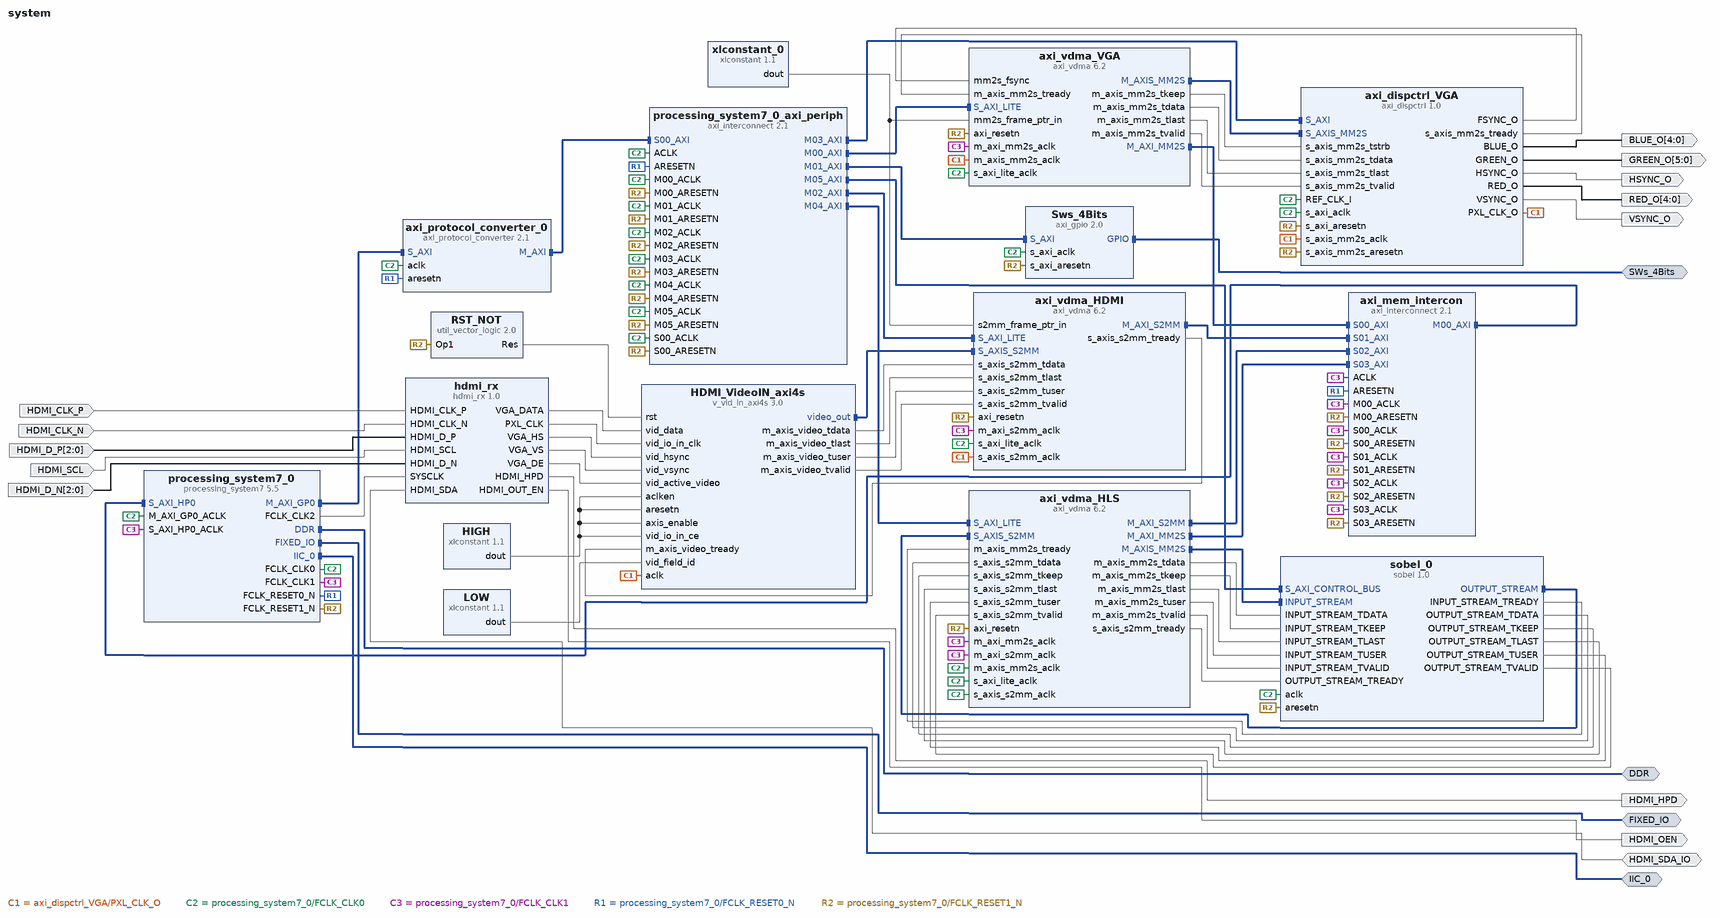
[diagram p0: block diagram of the top level]
# Vivado block design system, Vivado 2014.4
create_bd_design system

create_bd_intf_port -mode Master -vlnv xilinx.com:interface:ddrx_rtl:1.0 DDR
create_bd_intf_port -mode Master -vlnv xilinx.com:display_processing_system7:fixedio_rtl:1.0 FIXED_IO
create_bd_intf_port -mode Master -vlnv xilinx.com:interface:iic_rtl:1.0 IIC_0
create_bd_intf_port -mode Master -vlnv xilinx.com:interface:gpio_rtl:1.0 SWs_4Bits
create_bd_port -dir O HSYNC_O
create_bd_port -dir O VSYNC_O
create_bd_port -dir I HDMI_CLK_P
create_bd_port -dir I HDMI_CLK_N
create_bd_port -dir I -from 2 -to 0 HDMI_D_P
create_bd_port -dir I HDMI_SCL
create_bd_port -dir I -from 2 -to 0 HDMI_D_N
create_bd_port -dir O -from 4 -to 0 RED_O
create_bd_port -dir O -from 5 -to 0 GREEN_O
create_bd_port -dir O -from 4 -to 0 BLUE_O
create_bd_port -dir O HDMI_HPD
create_bd_port -dir O HDMI_OEN
create_bd_port -dir IO HDMI_SDA_IO

create_bd_cell -type ip -vlnv Digilent:digilent:axi_dispctrl:1.0 axi_dispctrl_VGA
set_property -dict {CONFIG.C_BLUE_WIDTH 5 CONFIG.C_GREEN_WIDTH 6 CONFIG.C_RED_WIDTH 5} [get_bd_cells axi_dispctrl_VGA]
create_bd_cell -type ip -vlnv xilinx.com:ip:axi_vdma:6.2 axi_vdma_VGA
set_property -dict [list \
  CONFIG.c_m_axi_mm2s_data_width 64 \
  CONFIG.c_m_axis_mm2s_tdata_width 32 \
  CONFIG.c_use_mm2s_fsync 1 \
  CONFIG.c_mm2s_genlock_mode 1 \
  CONFIG.c_mm2s_linebuffer_depth 2048 \
  CONFIG.c_mm2s_max_burst_length 8 \
  CONFIG.c_include_s2mm 0 \
  CONFIG.c_enable_debug_all 1 \
  CONFIG.c_enable_debug_info_6 0 \
  CONFIG.c_enable_debug_info_7 0 \
  CONFIG.c_enable_debug_info_14 0 \
  CONFIG.c_enable_debug_info_15 0 \
  CONFIG.c_include_mm2s_dre 1 \
] [get_bd_cells axi_vdma_VGA]
create_bd_cell -type ip -vlnv xilinx.com:ip:axi_vdma:6.2 axi_vdma_HDMI
set_property -dict [list \
  CONFIG.c_m_axi_s2mm_data_width 64 \
  CONFIG.c_include_s2mm_dre 1 \
  CONFIG.c_s2mm_genlock_mode 2 \
  CONFIG.c_s2mm_linebuffer_depth 2048 \
  CONFIG.c_include_mm2s 0 \
  CONFIG.c_include_s2mm 1 \
  CONFIG.c_enable_debug_all 1 \
  CONFIG.c_enable_debug_info_6 0 \
  CONFIG.c_enable_debug_info_7 0 \
  CONFIG.c_enable_debug_info_14 0 \
  CONFIG.c_enable_debug_info_15 0 \
] [get_bd_cells axi_vdma_HDMI]
create_bd_cell -type ip -vlnv xilinx.com:ip:processing_system7:5.5 processing_system7_0
set_property -dict [list \
  CONFIG.PCW_FCLK_CLK1_BUF true \
  CONFIG.PCW_FCLK_CLK2_BUF true \
  CONFIG.PCW_UIPARAM_DDR_FREQ_MHZ 525.000000 \
  CONFIG.PCW_CRYSTAL_PERIPHERAL_FREQMHZ 50.000000 \
  CONFIG.PCW_APU_PERIPHERAL_FREQMHZ 650.000000 \
  CONFIG.PCW_SDIO_PERIPHERAL_FREQMHZ 50 \
  CONFIG.PCW_UART_PERIPHERAL_FREQMHZ 50 \
  CONFIG.PCW_I2C_PERIPHERAL_FREQMHZ 108.333336 \
  CONFIG.PCW_FPGA0_PERIPHERAL_FREQMHZ 100.000000 \
  CONFIG.PCW_FPGA1_PERIPHERAL_FREQMHZ 150 \
  CONFIG.PCW_FPGA2_PERIPHERAL_FREQMHZ 200 \
  CONFIG.PCW_FPGA3_PERIPHERAL_FREQMHZ 200.000000 \
  CONFIG.PCW_USE_S_AXI_HP0 1 \
  CONFIG.PCW_M_AXI_GP0_FREQMHZ 100 \
  CONFIG.PCW_S_AXI_HP0_FREQMHZ 150 \
  CONFIG.PCW_USE_FABRIC_INTERRUPT 1 \
  CONFIG.PCW_EN_CLK1_PORT 1 \
  CONFIG.PCW_EN_CLK2_PORT 1 \
  CONFIG.PCW_EN_RST1_PORT 1 \
  CONFIG.PCW_IMPORT_BOARD_PRESET ./lib/xml/ZYBO_zynq_def.xml \
  CONFIG.PCW_PRESET_BANK1_VOLTAGE {LVCMOS 3.3V} \
  CONFIG.PCW_UIPARAM_DDR_PARTNO {MT41K128M16 JT-125} \
  CONFIG.PCW_QSPI_PERIPHERAL_ENABLE 1 \
  CONFIG.PCW_QSPI_QSPI_IO {MIO 1 .. 6} \
  CONFIG.PCW_QSPI_GRP_SINGLE_SS_ENABLE 1 \
  CONFIG.PCW_QSPI_GRP_SINGLE_SS_IO {MIO 1 .. 6} \
  CONFIG.PCW_QSPI_GRP_FBCLK_ENABLE 1 \
  CONFIG.PCW_QSPI_GRP_FBCLK_IO {MIO 8} \
  CONFIG.PCW_ENET0_PERIPHERAL_ENABLE 0 \
  CONFIG.PCW_SD0_PERIPHERAL_ENABLE 1 \
  CONFIG.PCW_SD0_SD0_IO {MIO 40 .. 45} \
  CONFIG.PCW_SD0_GRP_CD_ENABLE 1 \
  CONFIG.PCW_SD0_GRP_CD_IO {MIO 47} \
  CONFIG.PCW_SD0_GRP_WP_ENABLE 1 \
  CONFIG.PCW_SD0_GRP_WP_IO EMIO \
  CONFIG.PCW_UART1_PERIPHERAL_ENABLE 1 \
  CONFIG.PCW_UART1_UART1_IO {MIO 48 .. 49} \
  CONFIG.PCW_TTC0_PERIPHERAL_ENABLE 1 \
  CONFIG.PCW_USB0_PERIPHERAL_ENABLE 1 \
  CONFIG.PCW_USB0_USB0_IO {MIO 28 .. 39} \
  CONFIG.PCW_USB0_RESET_ENABLE 1 \
  CONFIG.PCW_USB0_RESET_IO {MIO 46} \
  CONFIG.PCW_I2C0_PERIPHERAL_ENABLE 1 \
  CONFIG.PCW_I2C0_I2C0_IO EMIO \
  CONFIG.PCW_I2C_RESET_ENABLE 0 \
  CONFIG.PCW_GPIO_PERIPHERAL_ENABLE 1 \
  CONFIG.PCW_GPIO_MIO_GPIO_ENABLE 1 \
  CONFIG.PCW_FCLK1_PERIPHERAL_CLKSRC {DDR PLL} \
  CONFIG.PCW_DCI_PERIPHERAL_CLKSRC 1 \
  CONFIG.PCW_PCAP_PERIPHERAL_CLKSRC 1 \
  CONFIG.PCW_FPGA_FCLK1_ENABLE 1 \
  CONFIG.PCW_FPGA_FCLK2_ENABLE 1 \
] [get_bd_cells processing_system7_0]
# 203 more settings of processing_system7_0 are not shown: defaults, MIO pin electricals, DDR timing, and values the tool derives
create_bd_cell -type ip -vlnv xilinx.com:ip:xlconstant:1.1 xlconstant_0
set_property -dict {CONFIG.CONST_WIDTH 6 CONFIG.CONST_VAL 0} [get_bd_cells xlconstant_0]
create_bd_cell -type ip -vlnv xilinx.com:ip:axi_interconnect:2.1 axi_mem_intercon
set_property -dict [list \
  CONFIG.NUM_SI 4 \
  CONFIG.NUM_MI 1 \
  CONFIG.ENABLE_ADVANCED_OPTIONS 0 \
  CONFIG.M00_HAS_DATA_FIFO 1 \
] [get_bd_cells axi_mem_intercon]
create_bd_cell -type ip -vlnv xilinx.com:ip:axi_protocol_converter:2.1 axi_protocol_converter_0
set_property -dict [list \
  CONFIG.SI_PROTOCOL AXI3 \
  CONFIG.MI_PROTOCOL AXI4LITE \
  CONFIG.ID_WIDTH 12 \
] [get_bd_cells axi_protocol_converter_0]
create_bd_cell -type ip -vlnv xilinx.com:ip:axi_interconnect:2.1 processing_system7_0_axi_periph
set_property -dict [list \
  CONFIG.NUM_MI 6 \
  CONFIG.STRATEGY 1 \
  CONFIG.ENABLE_ADVANCED_OPTIONS 0 \
  CONFIG.M00_HAS_REGSLICE 4 \
  CONFIG.M01_HAS_REGSLICE 4 \
  CONFIG.M02_HAS_REGSLICE 4 \
  CONFIG.M03_HAS_REGSLICE 4 \
  CONFIG.M04_HAS_REGSLICE 4 \
  CONFIG.M05_HAS_REGSLICE 4 \
  CONFIG.M06_HAS_REGSLICE 4 \
  CONFIG.M07_HAS_REGSLICE 4 \
] [get_bd_cells processing_system7_0_axi_periph]
create_bd_cell -type ip -vlnv xilinx.com:ip:v_vid_in_axi4s:3.0 HDMI_VideoIN_axi4s
set_property -dict [list \
  CONFIG.C_M_AXIS_VIDEO_MAX_TDATASMPLS_PER_CLK 1 \
  CONFIG.C_M_AXIS_VIDEO_DATA_WIDTH 10 \
  CONFIG.RAM_ADDR_BITS 11 \
] [get_bd_cells HDMI_VideoIN_axi4s]
create_bd_cell -type ip -vlnv xilinx.com:ip:util_vector_logic:2.0 RST_NOT
set_property -dict {CONFIG.C_SIZE 1 CONFIG.C_OPERATION not} [get_bd_cells RST_NOT]
create_bd_cell -type ip -vlnv xilinx.com:ip:xlconstant:1.1 HIGH
create_bd_cell -type ip -vlnv xilinx.com:ip:xlconstant:1.1 LOW
set_property -dict {CONFIG.CONST_VAL 0} [get_bd_cells LOW]
create_bd_cell -type ip -vlnv xilinx.com:ip:axi_vdma:6.2 axi_vdma_HLS
set_property -dict [list \
  CONFIG.c_m_axi_s2mm_data_width 64 \
  CONFIG.c_include_s2mm_dre 1 \
  CONFIG.c_use_mm2s_fsync 0 \
  CONFIG.c_use_s2mm_fsync 0 \
  CONFIG.c_mm2s_genlock_mode 3 \
  CONFIG.c_s2mm_genlock_mode 2 \
  CONFIG.c_mm2s_linebuffer_depth 2048 \
  CONFIG.c_s2mm_linebuffer_depth 2048 \
  CONFIG.c_include_mm2s 1 \
  CONFIG.c_include_s2mm 1 \
  CONFIG.c_enable_debug_all 1 \
  CONFIG.c_enable_debug_info_6 0 \
  CONFIG.c_enable_debug_info_7 0 \
  CONFIG.c_enable_debug_info_14 0 \
  CONFIG.c_enable_debug_info_15 0 \
  CONFIG.c_include_mm2s_dre 1 \
] [get_bd_cells axi_vdma_HLS]
create_bd_cell -type ip -vlnv xilinx.com:ip:hdmi_rx:1.0 hdmi_rx
create_bd_cell -type ip -vlnv xilinx.com:ip:axi_gpio:2.0 Sws_4Bits
set_property -dict {CONFIG.C_GPIO_WIDTH 4 CONFIG.C_ALL_INPUTS 1} [get_bd_cells Sws_4Bits]
create_bd_cell -type ip -vlnv xilinx.com:hls:sobel:1.0 sobel_0

# ---- connections ----

connect_bd_intf_net [get_bd_intf_pins axi_mem_intercon/M00_AXI] [get_bd_intf_pins processing_system7_0/S_AXI_HP0]
connect_bd_intf_net -intf_net axi_vdma_0_M_AXIS_MM2S [get_bd_intf_pins axi_dispctrl_VGA/S_AXIS_MM2S] [get_bd_intf_pins axi_vdma_VGA/M_AXIS_MM2S]
connect_bd_intf_net -intf_net axi_vdma_0_M_AXI_MM2S [get_bd_intf_pins axi_mem_intercon/S00_AXI] [get_bd_intf_pins axi_vdma_VGA/M_AXI_MM2S]
connect_bd_intf_net -intf_net processing_system7_0_M_AXI_GP0 [get_bd_intf_pins axi_protocol_converter_0/M_AXI] [get_bd_intf_pins processing_system7_0_axi_periph/S00_AXI]
connect_bd_intf_net [get_bd_intf_pins axi_protocol_converter_0/S_AXI] [get_bd_intf_pins processing_system7_0/M_AXI_GP0]
connect_bd_intf_net [get_bd_intf_pins axi_dispctrl_VGA/S_AXI] [get_bd_intf_pins processing_system7_0_axi_periph/M03_AXI]
connect_bd_intf_net [get_bd_intf_pins axi_vdma_HDMI/S_AXI_LITE] [get_bd_intf_pins processing_system7_0_axi_periph/M02_AXI]
connect_bd_intf_net [get_bd_intf_pins axi_vdma_VGA/S_AXI_LITE] [get_bd_intf_pins processing_system7_0_axi_periph/M00_AXI]
connect_bd_intf_net [get_bd_intf_pins HDMI_VideoIN_axi4s/video_out] [get_bd_intf_pins axi_vdma_HDMI/S_AXIS_S2MM]
connect_bd_intf_net [get_bd_intf_pins axi_vdma_HDMI/M_AXI_S2MM] [get_bd_intf_pins axi_mem_intercon/S01_AXI]
connect_bd_intf_net -intf_net axi_vdma_HDMI1_M_AXI_S2MM [get_bd_intf_pins axi_vdma_HLS/M_AXI_S2MM] [get_bd_intf_pins axi_mem_intercon/S02_AXI]
connect_bd_intf_net [get_bd_intf_pins axi_vdma_HLS/M_AXIS_MM2S] [get_bd_intf_pins sobel_0/INPUT_STREAM]
connect_bd_intf_net [get_bd_intf_pins axi_vdma_HLS/S_AXIS_S2MM] [get_bd_intf_pins sobel_0/OUTPUT_STREAM]
connect_bd_intf_net [get_bd_intf_pins axi_mem_intercon/S03_AXI] [get_bd_intf_pins axi_vdma_HLS/M_AXI_MM2S]
connect_bd_intf_net [get_bd_intf_pins processing_system7_0_axi_periph/M04_AXI] [get_bd_intf_pins axi_vdma_HLS/S_AXI_LITE]
connect_bd_intf_net [get_bd_intf_pins sobel_0/S_AXI_CONTROL_BUS] [get_bd_intf_pins processing_system7_0_axi_periph/M05_AXI]
connect_bd_intf_net [get_bd_intf_pins Sws_4Bits/S_AXI] [get_bd_intf_pins processing_system7_0_axi_periph/M01_AXI]
connect_bd_intf_net [get_bd_intf_ports DDR] [get_bd_intf_pins processing_system7_0/DDR]
connect_bd_intf_net [get_bd_intf_ports FIXED_IO] [get_bd_intf_pins processing_system7_0/FIXED_IO]
connect_bd_intf_net [get_bd_intf_ports IIC_0] [get_bd_intf_pins processing_system7_0/IIC_0]
connect_bd_intf_net [get_bd_intf_ports SWs_4Bits] [get_bd_intf_pins Sws_4Bits/GPIO]
connect_bd_net -net axi_dispctrl_0_FSYNC_O [get_bd_pins axi_dispctrl_VGA/FSYNC_O] [get_bd_pins axi_vdma_VGA/mm2s_fsync]
connect_bd_net -net axi_dispctrl_0_HSYNC_O [get_bd_pins axi_dispctrl_VGA/HSYNC_O] [get_bd_ports HSYNC_O]
connect_bd_net -net axi_dispctrl_0_PXL_CLK_O [get_bd_pins axi_dispctrl_VGA/PXL_CLK_O] \
  [get_bd_pins axi_dispctrl_VGA/s_axis_mm2s_aclk] [get_bd_pins axi_vdma_VGA/m_axis_mm2s_aclk] \
  [get_bd_pins axi_vdma_HDMI/s_axis_s2mm_aclk] [get_bd_pins HDMI_VideoIN_axi4s/aclk]
connect_bd_net -net axi_dispctrl_0_VSYNC_O [get_bd_pins axi_dispctrl_VGA/VSYNC_O] [get_bd_ports VSYNC_O]
connect_bd_net -net axi_vdma_0_m_axis_mm2s_tkeep [get_bd_pins axi_vdma_VGA/m_axis_mm2s_tkeep] [get_bd_pins axi_dispctrl_VGA/s_axis_mm2s_tstrb]
connect_bd_net [get_bd_pins processing_system7_0/FCLK_CLK0] \
  [get_bd_pins axi_dispctrl_VGA/REF_CLK_I] [get_bd_pins axi_dispctrl_VGA/s_axi_aclk] \
  [get_bd_pins axi_vdma_VGA/s_axi_lite_aclk] [get_bd_pins axi_vdma_HDMI/s_axi_lite_aclk] \
  [get_bd_pins processing_system7_0/M_AXI_GP0_ACLK] [get_bd_pins axi_protocol_converter_0/aclk] \
  [get_bd_pins axi_vdma_HLS/s_axi_lite_aclk] [get_bd_pins axi_vdma_HLS/s_axis_s2mm_aclk] \
  [get_bd_pins axi_vdma_HLS/m_axis_mm2s_aclk] [get_bd_pins Sws_4Bits/s_axi_aclk] [get_bd_pins sobel_0/aclk] \
  [get_bd_pins processing_system7_0_axi_periph/ACLK] [get_bd_pins processing_system7_0_axi_periph/S00_ACLK] \
  [get_bd_pins processing_system7_0_axi_periph/M00_ACLK] [get_bd_pins processing_system7_0_axi_periph/M01_ACLK] \
  [get_bd_pins processing_system7_0_axi_periph/M02_ACLK] [get_bd_pins processing_system7_0_axi_periph/M03_ACLK] \
  [get_bd_pins processing_system7_0_axi_periph/M04_ACLK] [get_bd_pins processing_system7_0_axi_periph/M05_ACLK]
connect_bd_net [get_bd_pins processing_system7_0/FCLK_CLK1] \
  [get_bd_pins axi_vdma_VGA/m_axi_mm2s_aclk] [get_bd_pins processing_system7_0/S_AXI_HP0_ACLK] \
  [get_bd_pins axi_vdma_HDMI/m_axi_s2mm_aclk] [get_bd_pins axi_vdma_HLS/m_axi_mm2s_aclk] \
  [get_bd_pins axi_vdma_HLS/m_axi_s2mm_aclk] [get_bd_pins axi_mem_intercon/ACLK] [get_bd_pins axi_mem_intercon/S00_ACLK] \
  [get_bd_pins axi_mem_intercon/S01_ACLK] [get_bd_pins axi_mem_intercon/M00_ACLK] [get_bd_pins axi_mem_intercon/S02_ACLK] \
  [get_bd_pins axi_mem_intercon/S03_ACLK]
connect_bd_net -net rst_processing_system7_0_97M_interconnect_aresetn [get_bd_pins processing_system7_0/FCLK_RESET0_N] \
  [get_bd_pins axi_protocol_converter_0/aresetn] [get_bd_pins axi_mem_intercon/ARESETN] \
  [get_bd_pins processing_system7_0_axi_periph/ARESETN]
connect_bd_net -net rst_processing_system7_0_97M_peripheral_aresetn [get_bd_pins processing_system7_0/FCLK_RESET1_N] \
  [get_bd_pins axi_dispctrl_VGA/s_axi_aresetn] [get_bd_pins axi_dispctrl_VGA/s_axis_mm2s_aresetn] \
  [get_bd_pins axi_vdma_VGA/axi_resetn] [get_bd_pins axi_vdma_HDMI/axi_resetn] [get_bd_pins RST_NOT/Op1] \
  [get_bd_pins axi_vdma_HLS/axi_resetn] [get_bd_pins Sws_4Bits/s_axi_aresetn] [get_bd_pins sobel_0/aresetn] \
  [get_bd_pins axi_mem_intercon/S00_ARESETN] [get_bd_pins axi_mem_intercon/S01_ARESETN] \
  [get_bd_pins axi_mem_intercon/M00_ARESETN] [get_bd_pins processing_system7_0_axi_periph/S00_ARESETN] \
  [get_bd_pins processing_system7_0_axi_periph/M00_ARESETN] [get_bd_pins processing_system7_0_axi_periph/M01_ARESETN] \
  [get_bd_pins processing_system7_0_axi_periph/M02_ARESETN] [get_bd_pins processing_system7_0_axi_periph/M03_ARESETN] \
  [get_bd_pins processing_system7_0_axi_periph/M04_ARESETN] [get_bd_pins processing_system7_0_axi_periph/M05_ARESETN] \
  [get_bd_pins axi_mem_intercon/S03_ARESETN] [get_bd_pins axi_mem_intercon/S02_ARESETN]
connect_bd_net -net xlconstant_0_const1 [get_bd_pins xlconstant_0/dout] \
  [get_bd_pins axi_vdma_VGA/mm2s_frame_ptr_in] [get_bd_pins axi_vdma_HDMI/s2mm_frame_ptr_in]
connect_bd_net -net hdmi_rx_0_VGA_DATA [get_bd_pins hdmi_rx/VGA_DATA] [get_bd_pins HDMI_VideoIN_axi4s/vid_data]
connect_bd_net [get_bd_ports HDMI_CLK_P] [get_bd_pins hdmi_rx/HDMI_CLK_P]
connect_bd_net [get_bd_ports HDMI_CLK_N] [get_bd_pins hdmi_rx/HDMI_CLK_N]
connect_bd_net [get_bd_ports HDMI_D_P] [get_bd_pins hdmi_rx/HDMI_D_P]
connect_bd_net -net hdmi_rx_0_PXL_CLK [get_bd_pins hdmi_rx/PXL_CLK] [get_bd_pins HDMI_VideoIN_axi4s/vid_io_in_clk]
connect_bd_net [get_bd_ports HDMI_SCL] [get_bd_pins hdmi_rx/HDMI_SCL]
connect_bd_net [get_bd_ports HDMI_D_N] [get_bd_pins hdmi_rx/HDMI_D_N]
connect_bd_net -net axi_dispctrl_0_RED_O [get_bd_pins axi_dispctrl_VGA/RED_O] [get_bd_ports RED_O]
connect_bd_net -net axi_dispctrl_0_GREEN_O [get_bd_pins axi_dispctrl_VGA/GREEN_O] [get_bd_ports GREEN_O]
connect_bd_net -net axi_dispctrl_0_BLUE_O [get_bd_pins axi_dispctrl_VGA/BLUE_O] [get_bd_ports BLUE_O]
connect_bd_net -net hdmi_rx_0_HDMI_HPD [get_bd_pins hdmi_rx/HDMI_HPD] [get_bd_ports HDMI_HPD]
connect_bd_net -net util_vector_logic_0_Res [get_bd_pins RST_NOT/Res] [get_bd_pins HDMI_VideoIN_axi4s/rst]
connect_bd_net [get_bd_pins hdmi_rx/HDMI_OUT_EN] [get_bd_ports HDMI_OEN]
connect_bd_net [get_bd_ports HDMI_SDA_IO] [get_bd_pins hdmi_rx/HDMI_SDA]
connect_bd_net [get_bd_pins HDMI_VideoIN_axi4s/m_axis_video_tdata] [get_bd_pins axi_vdma_HDMI/s_axis_s2mm_tdata]
connect_bd_net [get_bd_pins HDMI_VideoIN_axi4s/m_axis_video_tlast] [get_bd_pins axi_vdma_HDMI/s_axis_s2mm_tlast]
connect_bd_net [get_bd_pins axi_vdma_HDMI/s_axis_s2mm_tready] [get_bd_pins HDMI_VideoIN_axi4s/m_axis_video_tready]
connect_bd_net [get_bd_pins HDMI_VideoIN_axi4s/m_axis_video_tuser] [get_bd_pins axi_vdma_HDMI/s_axis_s2mm_tuser]
connect_bd_net [get_bd_pins HDMI_VideoIN_axi4s/m_axis_video_tvalid] [get_bd_pins axi_vdma_HDMI/s_axis_s2mm_tvalid]
connect_bd_net -net xlconstant_1_dout [get_bd_pins HIGH/dout] \
  [get_bd_pins HDMI_VideoIN_axi4s/vid_io_in_ce] [get_bd_pins HDMI_VideoIN_axi4s/aclken] \
  [get_bd_pins HDMI_VideoIN_axi4s/axis_enable] [get_bd_pins HDMI_VideoIN_axi4s/aresetn]
connect_bd_net [get_bd_pins hdmi_rx/VGA_HS] [get_bd_pins HDMI_VideoIN_axi4s/vid_hsync]
connect_bd_net [get_bd_pins hdmi_rx/VGA_VS] [get_bd_pins HDMI_VideoIN_axi4s/vid_vsync]
connect_bd_net [get_bd_pins hdmi_rx/VGA_DE] [get_bd_pins HDMI_VideoIN_axi4s/vid_active_video]
connect_bd_net [get_bd_pins LOW/dout] [get_bd_pins HDMI_VideoIN_axi4s/vid_field_id]
connect_bd_net [get_bd_pins axi_vdma_VGA/m_axis_mm2s_tdata] [get_bd_pins axi_dispctrl_VGA/s_axis_mm2s_tdata]
connect_bd_net [get_bd_pins axi_vdma_VGA/m_axis_mm2s_tlast] [get_bd_pins axi_dispctrl_VGA/s_axis_mm2s_tlast]
connect_bd_net [get_bd_pins axi_vdma_VGA/m_axis_mm2s_tvalid] [get_bd_pins axi_dispctrl_VGA/s_axis_mm2s_tvalid]
connect_bd_net [get_bd_pins axi_dispctrl_VGA/s_axis_mm2s_tready] [get_bd_pins axi_vdma_VGA/m_axis_mm2s_tready]
connect_bd_net [get_bd_pins processing_system7_0/FCLK_CLK2] [get_bd_pins hdmi_rx/SYSCLK]
connect_bd_net [get_bd_pins axi_vdma_HLS/m_axis_mm2s_tdata] [get_bd_pins sobel_0/INPUT_STREAM_TDATA]
connect_bd_net [get_bd_pins axi_vdma_HLS/m_axis_mm2s_tkeep] [get_bd_pins sobel_0/INPUT_STREAM_TKEEP]
connect_bd_net [get_bd_pins axi_vdma_HLS/m_axis_mm2s_tlast] [get_bd_pins sobel_0/INPUT_STREAM_TLAST]
connect_bd_net [get_bd_pins sobel_0/INPUT_STREAM_TREADY] [get_bd_pins axi_vdma_HLS/m_axis_mm2s_tready]
connect_bd_net [get_bd_pins axi_vdma_HLS/m_axis_mm2s_tuser] [get_bd_pins sobel_0/INPUT_STREAM_TUSER]
connect_bd_net [get_bd_pins axi_vdma_HLS/m_axis_mm2s_tvalid] [get_bd_pins sobel_0/INPUT_STREAM_TVALID]
connect_bd_net [get_bd_pins sobel_0/OUTPUT_STREAM_TDATA] [get_bd_pins axi_vdma_HLS/s_axis_s2mm_tdata]
connect_bd_net [get_bd_pins sobel_0/OUTPUT_STREAM_TKEEP] [get_bd_pins axi_vdma_HLS/s_axis_s2mm_tkeep]
connect_bd_net [get_bd_pins sobel_0/OUTPUT_STREAM_TLAST] [get_bd_pins axi_vdma_HLS/s_axis_s2mm_tlast]
connect_bd_net [get_bd_pins axi_vdma_HLS/s_axis_s2mm_tready] [get_bd_pins sobel_0/OUTPUT_STREAM_TREADY]
connect_bd_net [get_bd_pins sobel_0/OUTPUT_STREAM_TUSER] [get_bd_pins axi_vdma_HLS/s_axis_s2mm_tuser]
connect_bd_net [get_bd_pins sobel_0/OUTPUT_STREAM_TVALID] [get_bd_pins axi_vdma_HLS/s_axis_s2mm_tvalid]

# ---- address map ----
assign_bd_address -offset 0x0 -range 512M -target_address_space [get_bd_addr_spaces axi_vdma_HDMI/Data_S2MM] [get_bd_addr_segs processing_system7_0/S_AXI_HP0/HP0_DDR_LOWOCM]
assign_bd_address -offset 0x0 -range 512M -target_address_space [get_bd_addr_spaces axi_vdma_HLS/Data_MM2S] [get_bd_addr_segs processing_system7_0/S_AXI_HP0/HP0_DDR_LOWOCM]
assign_bd_address -offset 0x0 -range 512M -target_address_space [get_bd_addr_spaces axi_vdma_HLS/Data_S2MM] [get_bd_addr_segs processing_system7_0/S_AXI_HP0/HP0_DDR_LOWOCM]
assign_bd_address -offset 0x0 -range 512M -target_address_space [get_bd_addr_spaces axi_vdma_VGA/Data_MM2S] [get_bd_addr_segs processing_system7_0/S_AXI_HP0/HP0_DDR_LOWOCM]
assign_bd_address -offset 0x41200000 -range 64K -target_address_space [get_bd_addr_spaces processing_system7_0/Data] [get_bd_addr_segs Sws_4Bits/S_AXI/Reg]
assign_bd_address -offset 0x43000000 -range 64K -target_address_space [get_bd_addr_spaces processing_system7_0/Data] [get_bd_addr_segs axi_vdma_VGA/S_AXI_LITE/Reg]
assign_bd_address -offset 0x43010000 -range 64K -target_address_space [get_bd_addr_spaces processing_system7_0/Data] [get_bd_addr_segs axi_vdma_HDMI/S_AXI_LITE/Reg]
assign_bd_address -offset 0x43020000 -range 64K -target_address_space [get_bd_addr_spaces processing_system7_0/Data] [get_bd_addr_segs axi_vdma_HLS/S_AXI_LITE/Reg]
assign_bd_address -offset 0x43C00000 -range 64K -target_address_space [get_bd_addr_spaces processing_system7_0/Data] [get_bd_addr_segs axi_dispctrl_VGA/S_AXI/S_AXI_reg]
assign_bd_address -offset 0x43C10000 -range 64K -target_address_space [get_bd_addr_spaces processing_system7_0/Data] [get_bd_addr_segs sobel_0/S_AXI_CONTROL_BUS/Reg]

validate_bd_design
save_bd_design
